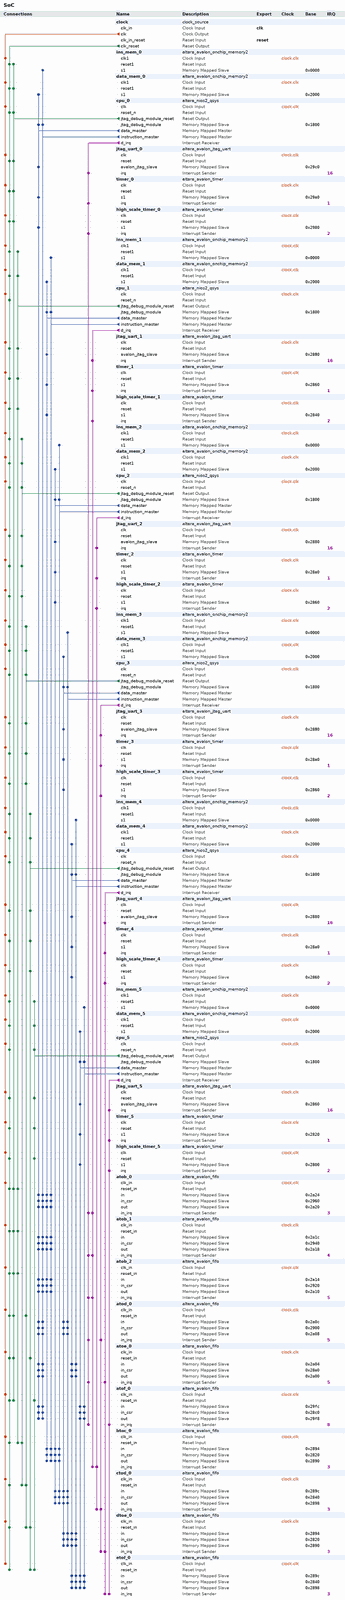
[diagram p0: system contents, whole]
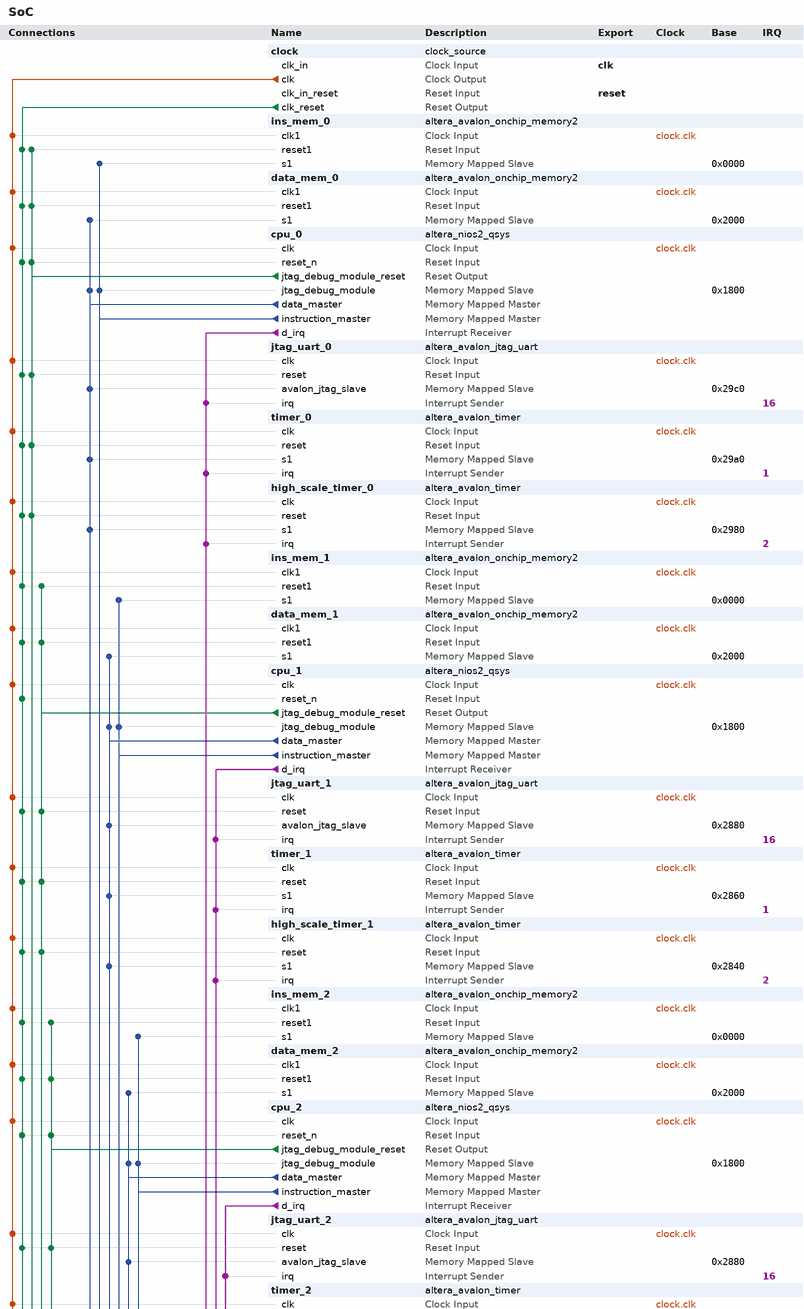
[diagram p1: system contents, upper part]
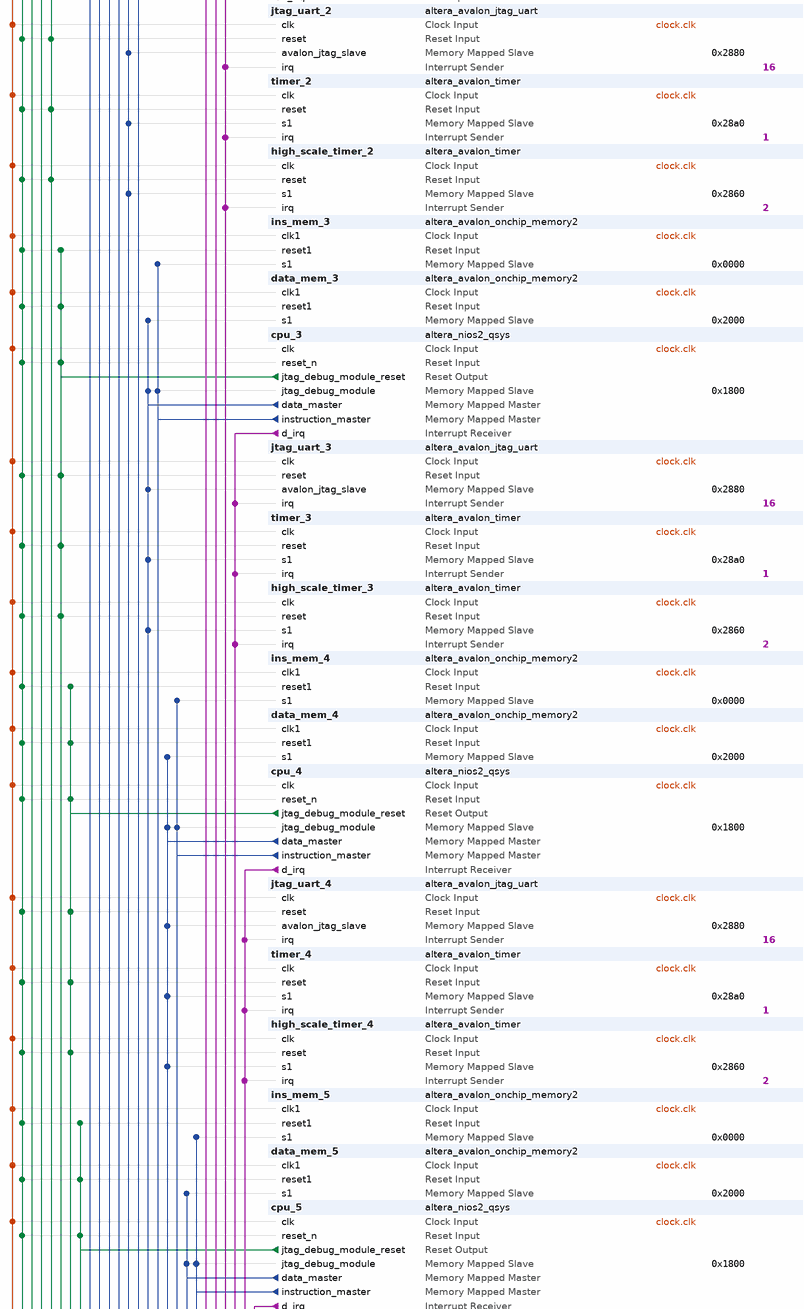
[diagram p2: system contents, middle part]
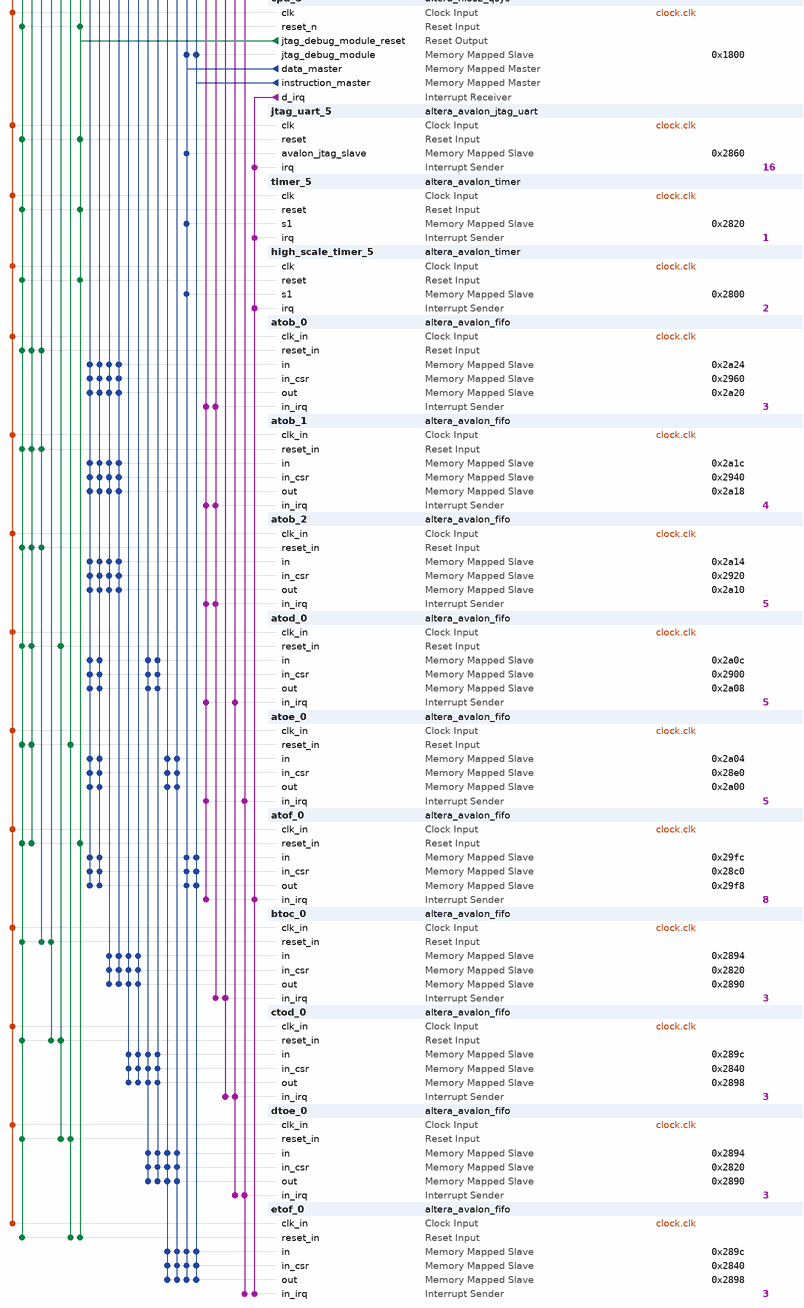
[diagram p3: system contents, lower part]
# Platform Designer (Qsys) system SoC, Cyclone IV E EP4CE115F29C7
# Parameters at their usual value, and those the tool derives, are not listed.
package require -exact qsys 12.1
create_system SoC
set_project_property DEVICE_FAMILY {Cyclone IV E}
set_project_property DEVICE EP4CE115F29C7

add_instance clock clock_source 12.1
set_instance_parameter_value clock clockFrequency 50000000

add_instance ins_mem_0 altera_avalon_onchip_memory2 12.1
set_instance_parameter_value ins_mem_0 dataWidth 32
set_instance_parameter_value ins_mem_0 dualPort false
set_instance_parameter_value ins_mem_0 initMemContent true
set_instance_parameter_value ins_mem_0 initializationFileName ins_mem_0
set_instance_parameter_value ins_mem_0 memorySize 4096

add_instance data_mem_0 altera_avalon_onchip_memory2 12.1
set_instance_parameter_value data_mem_0 dataWidth 32
set_instance_parameter_value data_mem_0 dualPort false
set_instance_parameter_value data_mem_0 initMemContent true
set_instance_parameter_value data_mem_0 initializationFileName data_mem_0
set_instance_parameter_value data_mem_0 memorySize 1365

add_instance cpu_0 altera_nios2_qsys 12.1
set_instance_parameter_value cpu_0 resetSlave ins_mem_0.s1
set_instance_parameter_value cpu_0 exceptionSlave ins_mem_0.s1
set_instance_parameter_value cpu_0 breakSlave cpu_0.jtag_debug_module
set_instance_parameter_value cpu_0 muldiv_multiplierType NoneSmall
set_instance_parameter_value cpu_0 impl Small
set_instance_parameter_value cpu_0 icache_size 4096

add_instance jtag_uart_0 altera_avalon_jtag_uart 12.1
set_instance_parameter_value jtag_uart_0 simInteractiveOptions INTERACTIVE_ASCII_OUTPUT

add_instance timer_0 altera_avalon_timer 12.1
set_instance_parameter_value timer_0 period 1
set_instance_parameter_value timer_0 periodUnits MSEC
set_instance_parameter_value timer_0 timerPreset FULL_FEATURED

add_instance high_scale_timer_0 altera_avalon_timer 12.1
set_instance_parameter_value high_scale_timer_0 period 1
set_instance_parameter_value high_scale_timer_0 periodUnits USEC
set_instance_parameter_value high_scale_timer_0 timerPreset FULL_FEATURED

add_instance ins_mem_1 altera_avalon_onchip_memory2 12.1
set_instance_parameter_value ins_mem_1 dataWidth 32
set_instance_parameter_value ins_mem_1 dualPort false
set_instance_parameter_value ins_mem_1 initMemContent true
set_instance_parameter_value ins_mem_1 initializationFileName ins_mem_1
set_instance_parameter_value ins_mem_1 memorySize 4096

add_instance data_mem_1 altera_avalon_onchip_memory2 12.1
set_instance_parameter_value data_mem_1 dataWidth 32
set_instance_parameter_value data_mem_1 dualPort false
set_instance_parameter_value data_mem_1 initMemContent true
set_instance_parameter_value data_mem_1 initializationFileName data_mem_1
set_instance_parameter_value data_mem_1 memorySize 1365

add_instance cpu_1 altera_nios2_qsys 12.1
set_instance_parameter_value cpu_1 resetSlave ins_mem_1.s1
set_instance_parameter_value cpu_1 exceptionSlave ins_mem_1.s1
set_instance_parameter_value cpu_1 breakSlave cpu_1.jtag_debug_module
set_instance_parameter_value cpu_1 muldiv_multiplierType NoneSmall
set_instance_parameter_value cpu_1 impl Small
set_instance_parameter_value cpu_1 icache_size 4096

add_instance jtag_uart_1 altera_avalon_jtag_uart 12.1
set_instance_parameter_value jtag_uart_1 simInteractiveOptions INTERACTIVE_ASCII_OUTPUT

add_instance timer_1 altera_avalon_timer 12.1
set_instance_parameter_value timer_1 period 1
set_instance_parameter_value timer_1 periodUnits MSEC
set_instance_parameter_value timer_1 timerPreset FULL_FEATURED

add_instance high_scale_timer_1 altera_avalon_timer 12.1
set_instance_parameter_value high_scale_timer_1 period 1
set_instance_parameter_value high_scale_timer_1 periodUnits USEC
set_instance_parameter_value high_scale_timer_1 timerPreset FULL_FEATURED

add_instance ins_mem_2 altera_avalon_onchip_memory2 12.1
set_instance_parameter_value ins_mem_2 dataWidth 32
set_instance_parameter_value ins_mem_2 dualPort false
set_instance_parameter_value ins_mem_2 initMemContent true
set_instance_parameter_value ins_mem_2 initializationFileName ins_mem_2
set_instance_parameter_value ins_mem_2 memorySize 4096

add_instance data_mem_2 altera_avalon_onchip_memory2 12.1
set_instance_parameter_value data_mem_2 dataWidth 32
set_instance_parameter_value data_mem_2 dualPort false
set_instance_parameter_value data_mem_2 initMemContent true
set_instance_parameter_value data_mem_2 initializationFileName data_mem_2
set_instance_parameter_value data_mem_2 memorySize 1365

add_instance cpu_2 altera_nios2_qsys 12.1
set_instance_parameter_value cpu_2 resetSlave ins_mem_2.s1
set_instance_parameter_value cpu_2 exceptionSlave ins_mem_2.s1
set_instance_parameter_value cpu_2 breakSlave cpu_2.jtag_debug_module
set_instance_parameter_value cpu_2 muldiv_multiplierType NoneSmall
set_instance_parameter_value cpu_2 impl Small
set_instance_parameter_value cpu_2 icache_size 4096

add_instance jtag_uart_2 altera_avalon_jtag_uart 12.1
set_instance_parameter_value jtag_uart_2 simInteractiveOptions INTERACTIVE_ASCII_OUTPUT

add_instance timer_2 altera_avalon_timer 12.1
set_instance_parameter_value timer_2 period 1
set_instance_parameter_value timer_2 periodUnits MSEC
set_instance_parameter_value timer_2 timerPreset FULL_FEATURED

add_instance high_scale_timer_2 altera_avalon_timer 12.1
set_instance_parameter_value high_scale_timer_2 period 1
set_instance_parameter_value high_scale_timer_2 periodUnits USEC
set_instance_parameter_value high_scale_timer_2 timerPreset FULL_FEATURED

add_instance ins_mem_3 altera_avalon_onchip_memory2 12.1
set_instance_parameter_value ins_mem_3 dataWidth 32
set_instance_parameter_value ins_mem_3 dualPort false
set_instance_parameter_value ins_mem_3 initMemContent true
set_instance_parameter_value ins_mem_3 initializationFileName ins_mem_3
set_instance_parameter_value ins_mem_3 memorySize 4096

add_instance data_mem_3 altera_avalon_onchip_memory2 12.1
set_instance_parameter_value data_mem_3 dataWidth 32
set_instance_parameter_value data_mem_3 dualPort false
set_instance_parameter_value data_mem_3 initMemContent true
set_instance_parameter_value data_mem_3 initializationFileName data_mem_3
set_instance_parameter_value data_mem_3 memorySize 1365

add_instance cpu_3 altera_nios2_qsys 12.1
set_instance_parameter_value cpu_3 resetSlave ins_mem_3.s1
set_instance_parameter_value cpu_3 exceptionSlave ins_mem_3.s1
set_instance_parameter_value cpu_3 breakSlave cpu_3.jtag_debug_module
set_instance_parameter_value cpu_3 muldiv_multiplierType NoneSmall
set_instance_parameter_value cpu_3 impl Small
set_instance_parameter_value cpu_3 icache_size 4096

add_instance jtag_uart_3 altera_avalon_jtag_uart 12.1
set_instance_parameter_value jtag_uart_3 simInteractiveOptions INTERACTIVE_ASCII_OUTPUT

add_instance timer_3 altera_avalon_timer 12.1
set_instance_parameter_value timer_3 period 1
set_instance_parameter_value timer_3 periodUnits MSEC
set_instance_parameter_value timer_3 timerPreset FULL_FEATURED

add_instance high_scale_timer_3 altera_avalon_timer 12.1
set_instance_parameter_value high_scale_timer_3 period 1
set_instance_parameter_value high_scale_timer_3 periodUnits USEC
set_instance_parameter_value high_scale_timer_3 timerPreset FULL_FEATURED

add_instance ins_mem_4 altera_avalon_onchip_memory2 12.1
set_instance_parameter_value ins_mem_4 dataWidth 32
set_instance_parameter_value ins_mem_4 dualPort false
set_instance_parameter_value ins_mem_4 initMemContent true
set_instance_parameter_value ins_mem_4 initializationFileName ins_mem_4
set_instance_parameter_value ins_mem_4 memorySize 4096

add_instance data_mem_4 altera_avalon_onchip_memory2 12.1
set_instance_parameter_value data_mem_4 dataWidth 32
set_instance_parameter_value data_mem_4 dualPort false
set_instance_parameter_value data_mem_4 initMemContent true
set_instance_parameter_value data_mem_4 initializationFileName data_mem_4
set_instance_parameter_value data_mem_4 memorySize 1365

add_instance cpu_4 altera_nios2_qsys 12.1
set_instance_parameter_value cpu_4 resetSlave ins_mem_4.s1
set_instance_parameter_value cpu_4 exceptionSlave ins_mem_4.s1
set_instance_parameter_value cpu_4 breakSlave cpu_4.jtag_debug_module
set_instance_parameter_value cpu_4 muldiv_multiplierType NoneSmall
set_instance_parameter_value cpu_4 impl Small
set_instance_parameter_value cpu_4 icache_size 4096

add_instance jtag_uart_4 altera_avalon_jtag_uart 12.1
set_instance_parameter_value jtag_uart_4 simInteractiveOptions INTERACTIVE_ASCII_OUTPUT

add_instance timer_4 altera_avalon_timer 12.1
set_instance_parameter_value timer_4 period 1
set_instance_parameter_value timer_4 periodUnits MSEC
set_instance_parameter_value timer_4 timerPreset FULL_FEATURED

add_instance high_scale_timer_4 altera_avalon_timer 12.1
set_instance_parameter_value high_scale_timer_4 period 1
set_instance_parameter_value high_scale_timer_4 periodUnits USEC
set_instance_parameter_value high_scale_timer_4 timerPreset FULL_FEATURED

add_instance ins_mem_5 altera_avalon_onchip_memory2 12.1
set_instance_parameter_value ins_mem_5 dataWidth 32
set_instance_parameter_value ins_mem_5 dualPort false
set_instance_parameter_value ins_mem_5 initMemContent true
set_instance_parameter_value ins_mem_5 initializationFileName ins_mem_5
set_instance_parameter_value ins_mem_5 memorySize 4096

add_instance data_mem_5 altera_avalon_onchip_memory2 12.1
set_instance_parameter_value data_mem_5 dataWidth 32
set_instance_parameter_value data_mem_5 dualPort false
set_instance_parameter_value data_mem_5 initMemContent true
set_instance_parameter_value data_mem_5 initializationFileName data_mem_5
set_instance_parameter_value data_mem_5 memorySize 1365

add_instance cpu_5 altera_nios2_qsys 12.1
set_instance_parameter_value cpu_5 resetSlave ins_mem_5.s1
set_instance_parameter_value cpu_5 exceptionSlave ins_mem_5.s1
set_instance_parameter_value cpu_5 breakSlave cpu_5.jtag_debug_module
set_instance_parameter_value cpu_5 muldiv_multiplierType NoneSmall
set_instance_parameter_value cpu_5 impl Small
set_instance_parameter_value cpu_5 icache_size 4096

add_instance jtag_uart_5 altera_avalon_jtag_uart 12.1
set_instance_parameter_value jtag_uart_5 simInteractiveOptions INTERACTIVE_ASCII_OUTPUT

add_instance timer_5 altera_avalon_timer 12.1
set_instance_parameter_value timer_5 period 1
set_instance_parameter_value timer_5 periodUnits MSEC
set_instance_parameter_value timer_5 timerPreset FULL_FEATURED

add_instance high_scale_timer_5 altera_avalon_timer 12.1
set_instance_parameter_value high_scale_timer_5 period 1
set_instance_parameter_value high_scale_timer_5 periodUnits USEC
set_instance_parameter_value high_scale_timer_5 timerPreset FULL_FEATURED

add_instance atob_0 altera_avalon_fifo 12.1
set_instance_parameter_value atob_0 bitsPerSymbol 16
set_instance_parameter_value atob_0 channelWidth 8
set_instance_parameter_value atob_0 errorWidth 8
set_instance_parameter_value atob_0 fifoDepth 16
set_instance_parameter_value atob_0 fifoInputInterfaceOptions AVALONMM_WRITE
set_instance_parameter_value atob_0 fifoOutputInterfaceOptions AVALONMM_READ
set_instance_parameter_value atob_0 singleClockMode true
set_instance_parameter_value atob_0 symbolsPerBeat 2
set_instance_parameter_value atob_0 useIRQ true
set_instance_parameter_value atob_0 usePacket true
set_instance_parameter_value atob_0 useReadControl false

add_instance atob_1 altera_avalon_fifo 12.1
set_instance_parameter_value atob_1 bitsPerSymbol 16
set_instance_parameter_value atob_1 channelWidth 8
set_instance_parameter_value atob_1 errorWidth 8
set_instance_parameter_value atob_1 fifoDepth 16
set_instance_parameter_value atob_1 fifoInputInterfaceOptions AVALONMM_WRITE
set_instance_parameter_value atob_1 fifoOutputInterfaceOptions AVALONMM_READ
set_instance_parameter_value atob_1 singleClockMode true
set_instance_parameter_value atob_1 symbolsPerBeat 2
set_instance_parameter_value atob_1 useIRQ true
set_instance_parameter_value atob_1 usePacket true
set_instance_parameter_value atob_1 useReadControl false

add_instance atob_2 altera_avalon_fifo 12.1
set_instance_parameter_value atob_2 bitsPerSymbol 16
set_instance_parameter_value atob_2 channelWidth 8
set_instance_parameter_value atob_2 errorWidth 8
set_instance_parameter_value atob_2 fifoDepth 16
set_instance_parameter_value atob_2 fifoInputInterfaceOptions AVALONMM_WRITE
set_instance_parameter_value atob_2 fifoOutputInterfaceOptions AVALONMM_READ
set_instance_parameter_value atob_2 singleClockMode true
set_instance_parameter_value atob_2 symbolsPerBeat 2
set_instance_parameter_value atob_2 useIRQ true
set_instance_parameter_value atob_2 usePacket true
set_instance_parameter_value atob_2 useReadControl false

add_instance atod_0 altera_avalon_fifo 12.1
set_instance_parameter_value atod_0 bitsPerSymbol 16
set_instance_parameter_value atod_0 channelWidth 8
set_instance_parameter_value atod_0 errorWidth 8
set_instance_parameter_value atod_0 fifoDepth 16
set_instance_parameter_value atod_0 fifoInputInterfaceOptions AVALONMM_WRITE
set_instance_parameter_value atod_0 fifoOutputInterfaceOptions AVALONMM_READ
set_instance_parameter_value atod_0 singleClockMode true
set_instance_parameter_value atod_0 symbolsPerBeat 2
set_instance_parameter_value atod_0 useIRQ true
set_instance_parameter_value atod_0 usePacket true
set_instance_parameter_value atod_0 useReadControl false

add_instance atoe_0 altera_avalon_fifo 12.1
set_instance_parameter_value atoe_0 bitsPerSymbol 16
set_instance_parameter_value atoe_0 channelWidth 8
set_instance_parameter_value atoe_0 errorWidth 8
set_instance_parameter_value atoe_0 fifoDepth 16
set_instance_parameter_value atoe_0 fifoInputInterfaceOptions AVALONMM_WRITE
set_instance_parameter_value atoe_0 fifoOutputInterfaceOptions AVALONMM_READ
set_instance_parameter_value atoe_0 singleClockMode true
set_instance_parameter_value atoe_0 symbolsPerBeat 2
set_instance_parameter_value atoe_0 useIRQ true
set_instance_parameter_value atoe_0 usePacket true
set_instance_parameter_value atoe_0 useReadControl false

add_instance atof_0 altera_avalon_fifo 12.1
set_instance_parameter_value atof_0 bitsPerSymbol 16
set_instance_parameter_value atof_0 channelWidth 8
set_instance_parameter_value atof_0 errorWidth 8
set_instance_parameter_value atof_0 fifoDepth 16
set_instance_parameter_value atof_0 fifoInputInterfaceOptions AVALONMM_WRITE
set_instance_parameter_value atof_0 fifoOutputInterfaceOptions AVALONMM_READ
set_instance_parameter_value atof_0 singleClockMode true
set_instance_parameter_value atof_0 symbolsPerBeat 2
set_instance_parameter_value atof_0 useIRQ true
set_instance_parameter_value atof_0 usePacket true
set_instance_parameter_value atof_0 useReadControl false

add_instance btoc_0 altera_avalon_fifo 12.1
set_instance_parameter_value btoc_0 bitsPerSymbol 16
set_instance_parameter_value btoc_0 channelWidth 8
set_instance_parameter_value btoc_0 errorWidth 8
set_instance_parameter_value btoc_0 fifoDepth 16
set_instance_parameter_value btoc_0 fifoInputInterfaceOptions AVALONMM_WRITE
set_instance_parameter_value btoc_0 fifoOutputInterfaceOptions AVALONMM_READ
set_instance_parameter_value btoc_0 singleClockMode true
set_instance_parameter_value btoc_0 symbolsPerBeat 2
set_instance_parameter_value btoc_0 useIRQ true
set_instance_parameter_value btoc_0 usePacket true
set_instance_parameter_value btoc_0 useReadControl false

add_instance ctod_0 altera_avalon_fifo 12.1
set_instance_parameter_value ctod_0 bitsPerSymbol 16
set_instance_parameter_value ctod_0 channelWidth 8
set_instance_parameter_value ctod_0 errorWidth 8
set_instance_parameter_value ctod_0 fifoDepth 16
set_instance_parameter_value ctod_0 fifoInputInterfaceOptions AVALONMM_WRITE
set_instance_parameter_value ctod_0 fifoOutputInterfaceOptions AVALONMM_READ
set_instance_parameter_value ctod_0 singleClockMode true
set_instance_parameter_value ctod_0 symbolsPerBeat 2
set_instance_parameter_value ctod_0 useIRQ true
set_instance_parameter_value ctod_0 usePacket true
set_instance_parameter_value ctod_0 useReadControl false

add_instance dtoe_0 altera_avalon_fifo 12.1
set_instance_parameter_value dtoe_0 bitsPerSymbol 16
set_instance_parameter_value dtoe_0 channelWidth 8
set_instance_parameter_value dtoe_0 errorWidth 8
set_instance_parameter_value dtoe_0 fifoDepth 16
set_instance_parameter_value dtoe_0 fifoInputInterfaceOptions AVALONMM_WRITE
set_instance_parameter_value dtoe_0 fifoOutputInterfaceOptions AVALONMM_READ
set_instance_parameter_value dtoe_0 singleClockMode true
set_instance_parameter_value dtoe_0 symbolsPerBeat 2
set_instance_parameter_value dtoe_0 useIRQ true
set_instance_parameter_value dtoe_0 usePacket true
set_instance_parameter_value dtoe_0 useReadControl false

add_instance etof_0 altera_avalon_fifo 12.1
set_instance_parameter_value etof_0 bitsPerSymbol 16
set_instance_parameter_value etof_0 channelWidth 8
set_instance_parameter_value etof_0 errorWidth 8
set_instance_parameter_value etof_0 fifoDepth 16
set_instance_parameter_value etof_0 fifoInputInterfaceOptions AVALONMM_WRITE
set_instance_parameter_value etof_0 fifoOutputInterfaceOptions AVALONMM_READ
set_instance_parameter_value etof_0 singleClockMode true
set_instance_parameter_value etof_0 symbolsPerBeat 2
set_instance_parameter_value etof_0 useIRQ true
set_instance_parameter_value etof_0 usePacket true
set_instance_parameter_value etof_0 useReadControl false

# connections
add_connection clock.clk atob_0.clk_in clock
add_connection clock.clk atob_1.clk_in clock
add_connection clock.clk atob_2.clk_in clock
add_connection clock.clk atod_0.clk_in clock
add_connection clock.clk atoe_0.clk_in clock
add_connection clock.clk atof_0.clk_in clock
add_connection clock.clk btoc_0.clk_in clock
add_connection clock.clk cpu_0.clk clock
add_connection clock.clk cpu_1.clk clock
add_connection clock.clk cpu_2.clk clock
add_connection clock.clk cpu_3.clk clock
add_connection clock.clk cpu_4.clk clock
add_connection clock.clk cpu_5.clk clock
add_connection clock.clk ctod_0.clk_in clock
add_connection clock.clk data_mem_0.clk1 clock
add_connection clock.clk data_mem_1.clk1 clock
add_connection clock.clk data_mem_2.clk1 clock
add_connection clock.clk data_mem_3.clk1 clock
add_connection clock.clk data_mem_4.clk1 clock
add_connection clock.clk data_mem_5.clk1 clock
add_connection clock.clk dtoe_0.clk_in clock
add_connection clock.clk etof_0.clk_in clock
add_connection clock.clk high_scale_timer_0.clk clock
add_connection clock.clk high_scale_timer_1.clk clock
add_connection clock.clk high_scale_timer_2.clk clock
add_connection clock.clk high_scale_timer_3.clk clock
add_connection clock.clk high_scale_timer_4.clk clock
add_connection clock.clk high_scale_timer_5.clk clock
add_connection clock.clk ins_mem_0.clk1 clock
add_connection clock.clk ins_mem_1.clk1 clock
add_connection clock.clk ins_mem_2.clk1 clock
add_connection clock.clk ins_mem_3.clk1 clock
add_connection clock.clk ins_mem_4.clk1 clock
add_connection clock.clk ins_mem_5.clk1 clock
add_connection clock.clk jtag_uart_0.clk clock
add_connection clock.clk jtag_uart_1.clk clock
add_connection clock.clk jtag_uart_2.clk clock
add_connection clock.clk jtag_uart_3.clk clock
add_connection clock.clk jtag_uart_4.clk clock
add_connection clock.clk jtag_uart_5.clk clock
add_connection clock.clk timer_0.clk clock
add_connection clock.clk timer_1.clk clock
add_connection clock.clk timer_2.clk clock
add_connection clock.clk timer_3.clk clock
add_connection clock.clk timer_4.clk clock
add_connection clock.clk timer_5.clk clock
add_connection clock.clk_reset atob_0.reset_in reset
add_connection clock.clk_reset atob_1.reset_in reset
add_connection clock.clk_reset atob_2.reset_in reset
add_connection clock.clk_reset atod_0.reset_in reset
add_connection clock.clk_reset atoe_0.reset_in reset
add_connection clock.clk_reset atof_0.reset_in reset
add_connection clock.clk_reset btoc_0.reset_in reset
add_connection clock.clk_reset cpu_0.reset_n reset
add_connection clock.clk_reset cpu_1.reset_n reset
add_connection clock.clk_reset cpu_2.reset_n reset
add_connection clock.clk_reset cpu_3.reset_n reset
add_connection clock.clk_reset cpu_4.reset_n reset
add_connection clock.clk_reset cpu_5.reset_n reset
add_connection clock.clk_reset ctod_0.reset_in reset
add_connection clock.clk_reset data_mem_0.reset1 reset
add_connection clock.clk_reset data_mem_1.reset1 reset
add_connection clock.clk_reset data_mem_2.reset1 reset
add_connection clock.clk_reset data_mem_3.reset1 reset
add_connection clock.clk_reset data_mem_4.reset1 reset
add_connection clock.clk_reset data_mem_5.reset1 reset
add_connection clock.clk_reset dtoe_0.reset_in reset
add_connection clock.clk_reset etof_0.reset_in reset
add_connection clock.clk_reset high_scale_timer_0.reset reset
add_connection clock.clk_reset high_scale_timer_1.reset reset
add_connection clock.clk_reset high_scale_timer_2.reset reset
add_connection clock.clk_reset high_scale_timer_3.reset reset
add_connection clock.clk_reset high_scale_timer_4.reset reset
add_connection clock.clk_reset high_scale_timer_5.reset reset
add_connection clock.clk_reset ins_mem_0.reset1 reset
add_connection clock.clk_reset ins_mem_1.reset1 reset
add_connection clock.clk_reset ins_mem_2.reset1 reset
add_connection clock.clk_reset ins_mem_3.reset1 reset
add_connection clock.clk_reset ins_mem_4.reset1 reset
add_connection clock.clk_reset ins_mem_5.reset1 reset
add_connection clock.clk_reset jtag_uart_0.reset reset
add_connection clock.clk_reset jtag_uart_1.reset reset
add_connection clock.clk_reset jtag_uart_2.reset reset
add_connection clock.clk_reset jtag_uart_3.reset reset
add_connection clock.clk_reset jtag_uart_4.reset reset
add_connection clock.clk_reset jtag_uart_5.reset reset
add_connection clock.clk_reset timer_0.reset reset
add_connection clock.clk_reset timer_1.reset reset
add_connection clock.clk_reset timer_2.reset reset
add_connection clock.clk_reset timer_3.reset reset
add_connection clock.clk_reset timer_4.reset reset
add_connection clock.clk_reset timer_5.reset reset
add_connection cpu_0.jtag_debug_module_reset atob_0.reset_in reset
add_connection cpu_0.jtag_debug_module_reset atob_1.reset_in reset
add_connection cpu_0.jtag_debug_module_reset atob_2.reset_in reset
add_connection cpu_0.jtag_debug_module_reset atod_0.reset_in reset
add_connection cpu_0.jtag_debug_module_reset atoe_0.reset_in reset
add_connection cpu_0.jtag_debug_module_reset atof_0.reset_in reset
add_connection cpu_0.jtag_debug_module_reset cpu_0.reset_n reset
add_connection cpu_0.jtag_debug_module_reset data_mem_0.reset1 reset
add_connection cpu_0.jtag_debug_module_reset high_scale_timer_0.reset reset
add_connection cpu_0.jtag_debug_module_reset ins_mem_0.reset1 reset
add_connection cpu_0.jtag_debug_module_reset jtag_uart_0.reset reset
add_connection cpu_0.jtag_debug_module_reset timer_0.reset reset
add_connection cpu_1.jtag_debug_module_reset atob_0.reset_in reset
add_connection cpu_1.jtag_debug_module_reset atob_1.reset_in reset
add_connection cpu_1.jtag_debug_module_reset atob_2.reset_in reset
add_connection cpu_1.jtag_debug_module_reset btoc_0.reset_in reset
add_connection cpu_1.jtag_debug_module_reset data_mem_1.reset1 reset
add_connection cpu_1.jtag_debug_module_reset high_scale_timer_1.reset reset
add_connection cpu_1.jtag_debug_module_reset ins_mem_1.reset1 reset
add_connection cpu_1.jtag_debug_module_reset jtag_uart_1.reset reset
add_connection cpu_1.jtag_debug_module_reset timer_1.reset reset
add_connection cpu_2.jtag_debug_module_reset btoc_0.reset_in reset
add_connection cpu_2.jtag_debug_module_reset cpu_2.reset_n reset
add_connection cpu_2.jtag_debug_module_reset ctod_0.reset_in reset
add_connection cpu_2.jtag_debug_module_reset data_mem_2.reset1 reset
add_connection cpu_2.jtag_debug_module_reset high_scale_timer_2.reset reset
add_connection cpu_2.jtag_debug_module_reset ins_mem_2.reset1 reset
add_connection cpu_2.jtag_debug_module_reset jtag_uart_2.reset reset
add_connection cpu_2.jtag_debug_module_reset timer_2.reset reset
add_connection cpu_3.jtag_debug_module_reset atod_0.reset_in reset
add_connection cpu_3.jtag_debug_module_reset cpu_3.reset_n reset
add_connection cpu_3.jtag_debug_module_reset ctod_0.reset_in reset
add_connection cpu_3.jtag_debug_module_reset data_mem_3.reset1 reset
add_connection cpu_3.jtag_debug_module_reset dtoe_0.reset_in reset
add_connection cpu_3.jtag_debug_module_reset high_scale_timer_3.reset reset
add_connection cpu_3.jtag_debug_module_reset ins_mem_3.reset1 reset
add_connection cpu_3.jtag_debug_module_reset jtag_uart_3.reset reset
add_connection cpu_3.jtag_debug_module_reset timer_3.reset reset
add_connection cpu_4.jtag_debug_module_reset atoe_0.reset_in reset
add_connection cpu_4.jtag_debug_module_reset cpu_4.reset_n reset
add_connection cpu_4.jtag_debug_module_reset data_mem_4.reset1 reset
add_connection cpu_4.jtag_debug_module_reset dtoe_0.reset_in reset
add_connection cpu_4.jtag_debug_module_reset etof_0.reset_in reset
add_connection cpu_4.jtag_debug_module_reset high_scale_timer_4.reset reset
add_connection cpu_4.jtag_debug_module_reset ins_mem_4.reset1 reset
add_connection cpu_4.jtag_debug_module_reset jtag_uart_4.reset reset
add_connection cpu_4.jtag_debug_module_reset timer_4.reset reset
add_connection cpu_5.jtag_debug_module_reset atof_0.reset_in reset
add_connection cpu_5.jtag_debug_module_reset cpu_5.reset_n reset
add_connection cpu_5.jtag_debug_module_reset data_mem_5.reset1 reset
add_connection cpu_5.jtag_debug_module_reset etof_0.reset_in reset
add_connection cpu_5.jtag_debug_module_reset high_scale_timer_5.reset reset
add_connection cpu_5.jtag_debug_module_reset ins_mem_5.reset1 reset
add_connection cpu_5.jtag_debug_module_reset jtag_uart_5.reset reset
add_connection cpu_5.jtag_debug_module_reset timer_5.reset reset
add_connection cpu_0.data_master atob_0.in avalon
set_connection_parameter_value cpu_0.data_master/atob_0.in baseAddress 0x2a24
add_connection cpu_0.data_master atob_0.in_csr avalon
set_connection_parameter_value cpu_0.data_master/atob_0.in_csr baseAddress 0x2960
add_connection cpu_0.data_master atob_0.out avalon
set_connection_parameter_value cpu_0.data_master/atob_0.out baseAddress 0x2a20
add_connection cpu_0.data_master atob_1.in avalon
set_connection_parameter_value cpu_0.data_master/atob_1.in baseAddress 0x2a1c
add_connection cpu_0.data_master atob_1.in_csr avalon
set_connection_parameter_value cpu_0.data_master/atob_1.in_csr baseAddress 0x2940
add_connection cpu_0.data_master atob_1.out avalon
set_connection_parameter_value cpu_0.data_master/atob_1.out baseAddress 0x2a18
add_connection cpu_0.data_master atob_2.in avalon
set_connection_parameter_value cpu_0.data_master/atob_2.in baseAddress 0x2a14
add_connection cpu_0.data_master atob_2.in_csr avalon
set_connection_parameter_value cpu_0.data_master/atob_2.in_csr baseAddress 0x2920
add_connection cpu_0.data_master atob_2.out avalon
set_connection_parameter_value cpu_0.data_master/atob_2.out baseAddress 0x2a10
add_connection cpu_0.data_master atod_0.in avalon
set_connection_parameter_value cpu_0.data_master/atod_0.in baseAddress 0x2a0c
add_connection cpu_0.data_master atod_0.in_csr avalon
set_connection_parameter_value cpu_0.data_master/atod_0.in_csr baseAddress 0x2900
add_connection cpu_0.data_master atod_0.out avalon
set_connection_parameter_value cpu_0.data_master/atod_0.out baseAddress 0x2a08
add_connection cpu_0.data_master atoe_0.in avalon
set_connection_parameter_value cpu_0.data_master/atoe_0.in baseAddress 0x2a04
add_connection cpu_0.data_master atoe_0.in_csr avalon
set_connection_parameter_value cpu_0.data_master/atoe_0.in_csr baseAddress 0x28e0
add_connection cpu_0.data_master atoe_0.out avalon
set_connection_parameter_value cpu_0.data_master/atoe_0.out baseAddress 0x2a00
add_connection cpu_0.data_master atof_0.in avalon
set_connection_parameter_value cpu_0.data_master/atof_0.in baseAddress 0x29fc
add_connection cpu_0.data_master atof_0.in_csr avalon
set_connection_parameter_value cpu_0.data_master/atof_0.in_csr baseAddress 0x28c0
add_connection cpu_0.data_master atof_0.out avalon
set_connection_parameter_value cpu_0.data_master/atof_0.out baseAddress 0x29f8
add_connection cpu_0.data_master cpu_0.jtag_debug_module avalon
set_connection_parameter_value cpu_0.data_master/cpu_0.jtag_debug_module baseAddress 0x1800
add_connection cpu_0.data_master data_mem_0.s1 avalon
set_connection_parameter_value cpu_0.data_master/data_mem_0.s1 baseAddress 0x2000
add_connection cpu_0.data_master high_scale_timer_0.s1 avalon
set_connection_parameter_value cpu_0.data_master/high_scale_timer_0.s1 baseAddress 0x2980
add_connection cpu_0.data_master jtag_uart_0.avalon_jtag_slave avalon
set_connection_parameter_value cpu_0.data_master/jtag_uart_0.avalon_jtag_slave baseAddress 0x29c0
add_connection cpu_0.data_master timer_0.s1 avalon
set_connection_parameter_value cpu_0.data_master/timer_0.s1 baseAddress 0x29a0
add_connection cpu_0.instruction_master atob_0.in avalon
set_connection_parameter_value cpu_0.instruction_master/atob_0.in baseAddress 0x2a24
add_connection cpu_0.instruction_master atob_0.in_csr avalon
set_connection_parameter_value cpu_0.instruction_master/atob_0.in_csr baseAddress 0x2960
add_connection cpu_0.instruction_master atob_0.out avalon
set_connection_parameter_value cpu_0.instruction_master/atob_0.out baseAddress 0x2a20
add_connection cpu_0.instruction_master atob_1.in avalon
set_connection_parameter_value cpu_0.instruction_master/atob_1.in baseAddress 0x2a1c
add_connection cpu_0.instruction_master atob_1.in_csr avalon
set_connection_parameter_value cpu_0.instruction_master/atob_1.in_csr baseAddress 0x2940
add_connection cpu_0.instruction_master atob_1.out avalon
set_connection_parameter_value cpu_0.instruction_master/atob_1.out baseAddress 0x2a18
add_connection cpu_0.instruction_master atob_2.in avalon
set_connection_parameter_value cpu_0.instruction_master/atob_2.in baseAddress 0x2a14
add_connection cpu_0.instruction_master atob_2.in_csr avalon
set_connection_parameter_value cpu_0.instruction_master/atob_2.in_csr baseAddress 0x2920
add_connection cpu_0.instruction_master atob_2.out avalon
set_connection_parameter_value cpu_0.instruction_master/atob_2.out baseAddress 0x2a10
add_connection cpu_0.instruction_master atod_0.in avalon
set_connection_parameter_value cpu_0.instruction_master/atod_0.in baseAddress 0x2a0c
add_connection cpu_0.instruction_master atod_0.in_csr avalon
set_connection_parameter_value cpu_0.instruction_master/atod_0.in_csr baseAddress 0x2900
add_connection cpu_0.instruction_master atod_0.out avalon
set_connection_parameter_value cpu_0.instruction_master/atod_0.out baseAddress 0x2a08
add_connection cpu_0.instruction_master atoe_0.in avalon
set_connection_parameter_value cpu_0.instruction_master/atoe_0.in baseAddress 0x2a04
add_connection cpu_0.instruction_master atoe_0.in_csr avalon
set_connection_parameter_value cpu_0.instruction_master/atoe_0.in_csr baseAddress 0x28e0
add_connection cpu_0.instruction_master atoe_0.out avalon
set_connection_parameter_value cpu_0.instruction_master/atoe_0.out baseAddress 0x2a00
add_connection cpu_0.instruction_master atof_0.in avalon
set_connection_parameter_value cpu_0.instruction_master/atof_0.in baseAddress 0x29fc
add_connection cpu_0.instruction_master atof_0.in_csr avalon
set_connection_parameter_value cpu_0.instruction_master/atof_0.in_csr baseAddress 0x28c0
add_connection cpu_0.instruction_master atof_0.out avalon
set_connection_parameter_value cpu_0.instruction_master/atof_0.out baseAddress 0x29f8
add_connection cpu_0.instruction_master cpu_0.jtag_debug_module avalon
set_connection_parameter_value cpu_0.instruction_master/cpu_0.jtag_debug_module baseAddress 0x1800
add_connection cpu_0.instruction_master ins_mem_0.s1 avalon
set_connection_parameter_value cpu_0.instruction_master/ins_mem_0.s1 baseAddress 0x0000
add_connection cpu_1.data_master atob_0.in avalon
set_connection_parameter_value cpu_1.data_master/atob_0.in baseAddress 0x2a24
add_connection cpu_1.data_master atob_0.in_csr avalon
set_connection_parameter_value cpu_1.data_master/atob_0.in_csr baseAddress 0x2960
add_connection cpu_1.data_master atob_0.out avalon
set_connection_parameter_value cpu_1.data_master/atob_0.out baseAddress 0x2a20
add_connection cpu_1.data_master atob_1.in avalon
set_connection_parameter_value cpu_1.data_master/atob_1.in baseAddress 0x2a1c
add_connection cpu_1.data_master atob_1.in_csr avalon
set_connection_parameter_value cpu_1.data_master/atob_1.in_csr baseAddress 0x2940
add_connection cpu_1.data_master atob_1.out avalon
set_connection_parameter_value cpu_1.data_master/atob_1.out baseAddress 0x2a18
add_connection cpu_1.data_master atob_2.in avalon
set_connection_parameter_value cpu_1.data_master/atob_2.in baseAddress 0x2a14
add_connection cpu_1.data_master atob_2.in_csr avalon
set_connection_parameter_value cpu_1.data_master/atob_2.in_csr baseAddress 0x2920
add_connection cpu_1.data_master atob_2.out avalon
set_connection_parameter_value cpu_1.data_master/atob_2.out baseAddress 0x2a10
add_connection cpu_1.data_master btoc_0.in avalon
set_connection_parameter_value cpu_1.data_master/btoc_0.in baseAddress 0x2894
add_connection cpu_1.data_master btoc_0.in_csr avalon
set_connection_parameter_value cpu_1.data_master/btoc_0.in_csr baseAddress 0x2820
add_connection cpu_1.data_master btoc_0.out avalon
set_connection_parameter_value cpu_1.data_master/btoc_0.out baseAddress 0x2890
add_connection cpu_1.data_master cpu_1.jtag_debug_module avalon
set_connection_parameter_value cpu_1.data_master/cpu_1.jtag_debug_module baseAddress 0x1800
add_connection cpu_1.data_master data_mem_1.s1 avalon
set_connection_parameter_value cpu_1.data_master/data_mem_1.s1 baseAddress 0x2000
add_connection cpu_1.data_master high_scale_timer_1.s1 avalon
set_connection_parameter_value cpu_1.data_master/high_scale_timer_1.s1 baseAddress 0x2840
add_connection cpu_1.data_master jtag_uart_1.avalon_jtag_slave avalon
set_connection_parameter_value cpu_1.data_master/jtag_uart_1.avalon_jtag_slave baseAddress 0x2880
add_connection cpu_1.data_master timer_1.s1 avalon
set_connection_parameter_value cpu_1.data_master/timer_1.s1 baseAddress 0x2860
add_connection cpu_1.instruction_master atob_0.in avalon
set_connection_parameter_value cpu_1.instruction_master/atob_0.in baseAddress 0x2a24
add_connection cpu_1.instruction_master atob_0.in_csr avalon
set_connection_parameter_value cpu_1.instruction_master/atob_0.in_csr baseAddress 0x2960
add_connection cpu_1.instruction_master atob_0.out avalon
set_connection_parameter_value cpu_1.instruction_master/atob_0.out baseAddress 0x2a20
add_connection cpu_1.instruction_master atob_1.in avalon
set_connection_parameter_value cpu_1.instruction_master/atob_1.in baseAddress 0x2a1c
add_connection cpu_1.instruction_master atob_1.in_csr avalon
set_connection_parameter_value cpu_1.instruction_master/atob_1.in_csr baseAddress 0x2940
add_connection cpu_1.instruction_master atob_1.out avalon
set_connection_parameter_value cpu_1.instruction_master/atob_1.out baseAddress 0x2a18
add_connection cpu_1.instruction_master atob_2.in avalon
set_connection_parameter_value cpu_1.instruction_master/atob_2.in baseAddress 0x2a14
add_connection cpu_1.instruction_master atob_2.in_csr avalon
set_connection_parameter_value cpu_1.instruction_master/atob_2.in_csr baseAddress 0x2920
add_connection cpu_1.instruction_master atob_2.out avalon
set_connection_parameter_value cpu_1.instruction_master/atob_2.out baseAddress 0x2a10
add_connection cpu_1.instruction_master btoc_0.in avalon
set_connection_parameter_value cpu_1.instruction_master/btoc_0.in baseAddress 0x2894
add_connection cpu_1.instruction_master btoc_0.in_csr avalon
set_connection_parameter_value cpu_1.instruction_master/btoc_0.in_csr baseAddress 0x2820
add_connection cpu_1.instruction_master btoc_0.out avalon
set_connection_parameter_value cpu_1.instruction_master/btoc_0.out baseAddress 0x2890
add_connection cpu_1.instruction_master cpu_1.jtag_debug_module avalon
set_connection_parameter_value cpu_1.instruction_master/cpu_1.jtag_debug_module baseAddress 0x1800
add_connection cpu_1.instruction_master ins_mem_1.s1 avalon
set_connection_parameter_value cpu_1.instruction_master/ins_mem_1.s1 baseAddress 0x0000
add_connection cpu_2.data_master btoc_0.in avalon
set_connection_parameter_value cpu_2.data_master/btoc_0.in baseAddress 0x2894
add_connection cpu_2.data_master btoc_0.in_csr avalon
set_connection_parameter_value cpu_2.data_master/btoc_0.in_csr baseAddress 0x2820
add_connection cpu_2.data_master btoc_0.out avalon
set_connection_parameter_value cpu_2.data_master/btoc_0.out baseAddress 0x2890
add_connection cpu_2.data_master cpu_2.jtag_debug_module avalon
set_connection_parameter_value cpu_2.data_master/cpu_2.jtag_debug_module baseAddress 0x1800
add_connection cpu_2.data_master ctod_0.in avalon
set_connection_parameter_value cpu_2.data_master/ctod_0.in baseAddress 0x289c
add_connection cpu_2.data_master ctod_0.in_csr avalon
set_connection_parameter_value cpu_2.data_master/ctod_0.in_csr baseAddress 0x2840
add_connection cpu_2.data_master ctod_0.out avalon
set_connection_parameter_value cpu_2.data_master/ctod_0.out baseAddress 0x2898
add_connection cpu_2.data_master data_mem_2.s1 avalon
set_connection_parameter_value cpu_2.data_master/data_mem_2.s1 baseAddress 0x2000
add_connection cpu_2.data_master high_scale_timer_2.s1 avalon
set_connection_parameter_value cpu_2.data_master/high_scale_timer_2.s1 baseAddress 0x2860
add_connection cpu_2.data_master jtag_uart_2.avalon_jtag_slave avalon
set_connection_parameter_value cpu_2.data_master/jtag_uart_2.avalon_jtag_slave baseAddress 0x2880
add_connection cpu_2.data_master timer_2.s1 avalon
set_connection_parameter_value cpu_2.data_master/timer_2.s1 baseAddress 0x28a0
add_connection cpu_2.instruction_master btoc_0.in avalon
set_connection_parameter_value cpu_2.instruction_master/btoc_0.in baseAddress 0x2894
add_connection cpu_2.instruction_master btoc_0.in_csr avalon
set_connection_parameter_value cpu_2.instruction_master/btoc_0.in_csr baseAddress 0x2820
add_connection cpu_2.instruction_master btoc_0.out avalon
set_connection_parameter_value cpu_2.instruction_master/btoc_0.out baseAddress 0x2890
add_connection cpu_2.instruction_master cpu_2.jtag_debug_module avalon
set_connection_parameter_value cpu_2.instruction_master/cpu_2.jtag_debug_module baseAddress 0x1800
add_connection cpu_2.instruction_master ctod_0.in avalon
set_connection_parameter_value cpu_2.instruction_master/ctod_0.in baseAddress 0x289c
add_connection cpu_2.instruction_master ctod_0.in_csr avalon
set_connection_parameter_value cpu_2.instruction_master/ctod_0.in_csr baseAddress 0x2840
add_connection cpu_2.instruction_master ctod_0.out avalon
set_connection_parameter_value cpu_2.instruction_master/ctod_0.out baseAddress 0x2898
add_connection cpu_2.instruction_master ins_mem_2.s1 avalon
set_connection_parameter_value cpu_2.instruction_master/ins_mem_2.s1 baseAddress 0x0000
add_connection cpu_3.data_master atod_0.in avalon
set_connection_parameter_value cpu_3.data_master/atod_0.in baseAddress 0x2a0c
add_connection cpu_3.data_master atod_0.in_csr avalon
set_connection_parameter_value cpu_3.data_master/atod_0.in_csr baseAddress 0x2900
add_connection cpu_3.data_master atod_0.out avalon
set_connection_parameter_value cpu_3.data_master/atod_0.out baseAddress 0x2a08
add_connection cpu_3.data_master cpu_3.jtag_debug_module avalon
set_connection_parameter_value cpu_3.data_master/cpu_3.jtag_debug_module baseAddress 0x1800
add_connection cpu_3.data_master ctod_0.in avalon
set_connection_parameter_value cpu_3.data_master/ctod_0.in baseAddress 0x289c
add_connection cpu_3.data_master ctod_0.in_csr avalon
set_connection_parameter_value cpu_3.data_master/ctod_0.in_csr baseAddress 0x2840
add_connection cpu_3.data_master ctod_0.out avalon
set_connection_parameter_value cpu_3.data_master/ctod_0.out baseAddress 0x2898
add_connection cpu_3.data_master data_mem_3.s1 avalon
set_connection_parameter_value cpu_3.data_master/data_mem_3.s1 baseAddress 0x2000
add_connection cpu_3.data_master dtoe_0.in avalon
set_connection_parameter_value cpu_3.data_master/dtoe_0.in baseAddress 0x2894
add_connection cpu_3.data_master dtoe_0.in_csr avalon
set_connection_parameter_value cpu_3.data_master/dtoe_0.in_csr baseAddress 0x2820
add_connection cpu_3.data_master dtoe_0.out avalon
set_connection_parameter_value cpu_3.data_master/dtoe_0.out baseAddress 0x2890
add_connection cpu_3.data_master high_scale_timer_3.s1 avalon
set_connection_parameter_value cpu_3.data_master/high_scale_timer_3.s1 baseAddress 0x2860
add_connection cpu_3.data_master jtag_uart_3.avalon_jtag_slave avalon
set_connection_parameter_value cpu_3.data_master/jtag_uart_3.avalon_jtag_slave baseAddress 0x2880
add_connection cpu_3.data_master timer_3.s1 avalon
set_connection_parameter_value cpu_3.data_master/timer_3.s1 baseAddress 0x28a0
add_connection cpu_3.instruction_master atod_0.in avalon
set_connection_parameter_value cpu_3.instruction_master/atod_0.in baseAddress 0x2a0c
add_connection cpu_3.instruction_master atod_0.in_csr avalon
set_connection_parameter_value cpu_3.instruction_master/atod_0.in_csr baseAddress 0x2900
add_connection cpu_3.instruction_master atod_0.out avalon
set_connection_parameter_value cpu_3.instruction_master/atod_0.out baseAddress 0x2a08
add_connection cpu_3.instruction_master cpu_3.jtag_debug_module avalon
set_connection_parameter_value cpu_3.instruction_master/cpu_3.jtag_debug_module baseAddress 0x1800
add_connection cpu_3.instruction_master ctod_0.in avalon
set_connection_parameter_value cpu_3.instruction_master/ctod_0.in baseAddress 0x289c
add_connection cpu_3.instruction_master ctod_0.in_csr avalon
set_connection_parameter_value cpu_3.instruction_master/ctod_0.in_csr baseAddress 0x2840
add_connection cpu_3.instruction_master ctod_0.out avalon
set_connection_parameter_value cpu_3.instruction_master/ctod_0.out baseAddress 0x2898
add_connection cpu_3.instruction_master dtoe_0.in avalon
set_connection_parameter_value cpu_3.instruction_master/dtoe_0.in baseAddress 0x2894
add_connection cpu_3.instruction_master dtoe_0.in_csr avalon
set_connection_parameter_value cpu_3.instruction_master/dtoe_0.in_csr baseAddress 0x2820
add_connection cpu_3.instruction_master dtoe_0.out avalon
set_connection_parameter_value cpu_3.instruction_master/dtoe_0.out baseAddress 0x2890
add_connection cpu_3.instruction_master ins_mem_3.s1 avalon
set_connection_parameter_value cpu_3.instruction_master/ins_mem_3.s1 baseAddress 0x0000
add_connection cpu_4.data_master atoe_0.in avalon
set_connection_parameter_value cpu_4.data_master/atoe_0.in baseAddress 0x2a04
add_connection cpu_4.data_master atoe_0.in_csr avalon
set_connection_parameter_value cpu_4.data_master/atoe_0.in_csr baseAddress 0x28e0
add_connection cpu_4.data_master atoe_0.out avalon
set_connection_parameter_value cpu_4.data_master/atoe_0.out baseAddress 0x2a00
add_connection cpu_4.data_master cpu_4.jtag_debug_module avalon
set_connection_parameter_value cpu_4.data_master/cpu_4.jtag_debug_module baseAddress 0x1800
add_connection cpu_4.data_master data_mem_4.s1 avalon
set_connection_parameter_value cpu_4.data_master/data_mem_4.s1 baseAddress 0x2000
add_connection cpu_4.data_master dtoe_0.in avalon
set_connection_parameter_value cpu_4.data_master/dtoe_0.in baseAddress 0x2894
add_connection cpu_4.data_master dtoe_0.in_csr avalon
set_connection_parameter_value cpu_4.data_master/dtoe_0.in_csr baseAddress 0x2820
add_connection cpu_4.data_master dtoe_0.out avalon
set_connection_parameter_value cpu_4.data_master/dtoe_0.out baseAddress 0x2890
add_connection cpu_4.data_master etof_0.in avalon
set_connection_parameter_value cpu_4.data_master/etof_0.in baseAddress 0x289c
add_connection cpu_4.data_master etof_0.in_csr avalon
set_connection_parameter_value cpu_4.data_master/etof_0.in_csr baseAddress 0x2840
add_connection cpu_4.data_master etof_0.out avalon
set_connection_parameter_value cpu_4.data_master/etof_0.out baseAddress 0x2898
add_connection cpu_4.data_master high_scale_timer_4.s1 avalon
set_connection_parameter_value cpu_4.data_master/high_scale_timer_4.s1 baseAddress 0x2860
add_connection cpu_4.data_master jtag_uart_4.avalon_jtag_slave avalon
set_connection_parameter_value cpu_4.data_master/jtag_uart_4.avalon_jtag_slave baseAddress 0x2880
add_connection cpu_4.data_master timer_4.s1 avalon
set_connection_parameter_value cpu_4.data_master/timer_4.s1 baseAddress 0x28a0
add_connection cpu_4.instruction_master atoe_0.in avalon
set_connection_parameter_value cpu_4.instruction_master/atoe_0.in baseAddress 0x2a04
add_connection cpu_4.instruction_master atoe_0.in_csr avalon
set_connection_parameter_value cpu_4.instruction_master/atoe_0.in_csr baseAddress 0x28e0
add_connection cpu_4.instruction_master atoe_0.out avalon
set_connection_parameter_value cpu_4.instruction_master/atoe_0.out baseAddress 0x2a00
add_connection cpu_4.instruction_master cpu_4.jtag_debug_module avalon
set_connection_parameter_value cpu_4.instruction_master/cpu_4.jtag_debug_module baseAddress 0x1800
add_connection cpu_4.instruction_master dtoe_0.in avalon
set_connection_parameter_value cpu_4.instruction_master/dtoe_0.in baseAddress 0x2894
add_connection cpu_4.instruction_master dtoe_0.in_csr avalon
set_connection_parameter_value cpu_4.instruction_master/dtoe_0.in_csr baseAddress 0x2820
add_connection cpu_4.instruction_master dtoe_0.out avalon
set_connection_parameter_value cpu_4.instruction_master/dtoe_0.out baseAddress 0x2890
add_connection cpu_4.instruction_master etof_0.in avalon
set_connection_parameter_value cpu_4.instruction_master/etof_0.in baseAddress 0x289c
add_connection cpu_4.instruction_master etof_0.in_csr avalon
set_connection_parameter_value cpu_4.instruction_master/etof_0.in_csr baseAddress 0x2840
add_connection cpu_4.instruction_master etof_0.out avalon
set_connection_parameter_value cpu_4.instruction_master/etof_0.out baseAddress 0x2898
add_connection cpu_4.instruction_master ins_mem_4.s1 avalon
set_connection_parameter_value cpu_4.instruction_master/ins_mem_4.s1 baseAddress 0x0000
add_connection cpu_5.data_master atof_0.in avalon
set_connection_parameter_value cpu_5.data_master/atof_0.in baseAddress 0x29fc
add_connection cpu_5.data_master atof_0.in_csr avalon
set_connection_parameter_value cpu_5.data_master/atof_0.in_csr baseAddress 0x28c0
add_connection cpu_5.data_master atof_0.out avalon
set_connection_parameter_value cpu_5.data_master/atof_0.out baseAddress 0x29f8
add_connection cpu_5.data_master cpu_5.jtag_debug_module avalon
set_connection_parameter_value cpu_5.data_master/cpu_5.jtag_debug_module baseAddress 0x1800
add_connection cpu_5.data_master data_mem_5.s1 avalon
set_connection_parameter_value cpu_5.data_master/data_mem_5.s1 baseAddress 0x2000
add_connection cpu_5.data_master etof_0.in avalon
set_connection_parameter_value cpu_5.data_master/etof_0.in baseAddress 0x289c
add_connection cpu_5.data_master etof_0.in_csr avalon
set_connection_parameter_value cpu_5.data_master/etof_0.in_csr baseAddress 0x2840
add_connection cpu_5.data_master etof_0.out avalon
set_connection_parameter_value cpu_5.data_master/etof_0.out baseAddress 0x2898
add_connection cpu_5.data_master high_scale_timer_5.s1 avalon
set_connection_parameter_value cpu_5.data_master/high_scale_timer_5.s1 baseAddress 0x2800
add_connection cpu_5.data_master jtag_uart_5.avalon_jtag_slave avalon
set_connection_parameter_value cpu_5.data_master/jtag_uart_5.avalon_jtag_slave baseAddress 0x2860
add_connection cpu_5.data_master timer_5.s1 avalon
set_connection_parameter_value cpu_5.data_master/timer_5.s1 baseAddress 0x2820
add_connection cpu_5.instruction_master atof_0.in avalon
set_connection_parameter_value cpu_5.instruction_master/atof_0.in baseAddress 0x29fc
add_connection cpu_5.instruction_master atof_0.in_csr avalon
set_connection_parameter_value cpu_5.instruction_master/atof_0.in_csr baseAddress 0x28c0
add_connection cpu_5.instruction_master atof_0.out avalon
set_connection_parameter_value cpu_5.instruction_master/atof_0.out baseAddress 0x29f8
add_connection cpu_5.instruction_master cpu_5.jtag_debug_module avalon
set_connection_parameter_value cpu_5.instruction_master/cpu_5.jtag_debug_module baseAddress 0x1800
add_connection cpu_5.instruction_master etof_0.in avalon
set_connection_parameter_value cpu_5.instruction_master/etof_0.in baseAddress 0x289c
add_connection cpu_5.instruction_master etof_0.in_csr avalon
set_connection_parameter_value cpu_5.instruction_master/etof_0.in_csr baseAddress 0x2840
add_connection cpu_5.instruction_master etof_0.out avalon
set_connection_parameter_value cpu_5.instruction_master/etof_0.out baseAddress 0x2898
add_connection cpu_5.instruction_master ins_mem_5.s1 avalon
set_connection_parameter_value cpu_5.instruction_master/ins_mem_5.s1 baseAddress 0x0000
add_connection cpu_0.d_irq atob_0.in_irq interrupt
set_connection_parameter_value cpu_0.d_irq/atob_0.in_irq irqNumber 3
add_connection cpu_0.d_irq atob_1.in_irq interrupt
set_connection_parameter_value cpu_0.d_irq/atob_1.in_irq irqNumber 4
add_connection cpu_0.d_irq atob_2.in_irq interrupt
set_connection_parameter_value cpu_0.d_irq/atob_2.in_irq irqNumber 5
add_connection cpu_0.d_irq atod_0.in_irq interrupt
set_connection_parameter_value cpu_0.d_irq/atod_0.in_irq irqNumber 6
add_connection cpu_0.d_irq atoe_0.in_irq interrupt
set_connection_parameter_value cpu_0.d_irq/atoe_0.in_irq irqNumber 7
add_connection cpu_0.d_irq atof_0.in_irq interrupt
set_connection_parameter_value cpu_0.d_irq/atof_0.in_irq irqNumber 8
add_connection cpu_0.d_irq high_scale_timer_0.irq interrupt
set_connection_parameter_value cpu_0.d_irq/high_scale_timer_0.irq irqNumber 2
